# EAGLE design nedo32v1 (EAGLE 5.06)
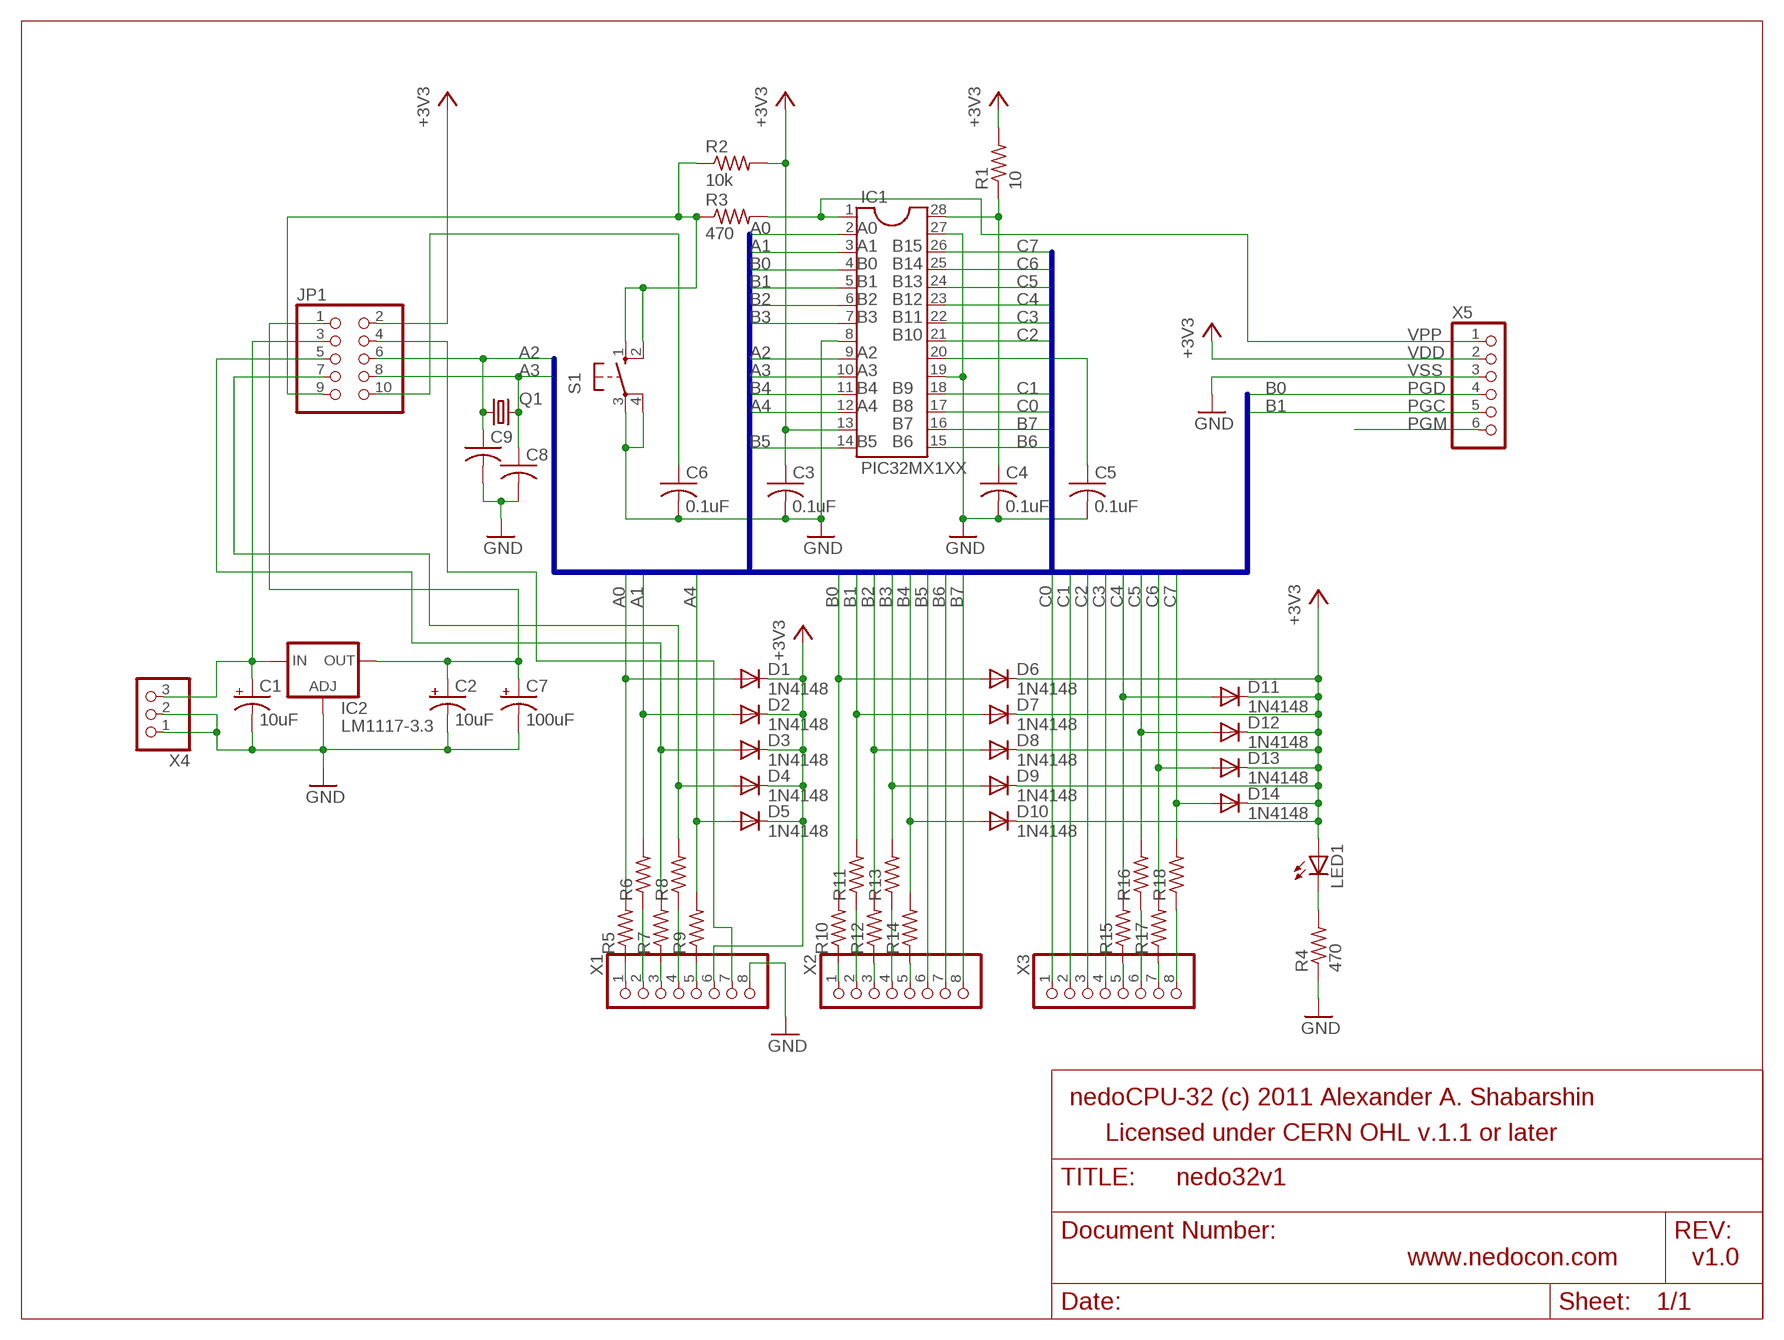
[diagram p0: schematic, sheet 1]

## Parts
C1  10uF  CPOL-USE2,5-6E  [E2,5-6E]
C2  10uF  CPOL-USE2,5-6E  [E2,5-6E]
C3  0.1uF  C-US025-025X050  [C025-025X050]
C4  0.1uF  C-US025-025X050  [C025-025X050]
C5  0.1uF  C-US025-025X050  [C025-025X050]
C6  0.1uF  C-US025-025X050  [C025-025X050]
C7  100uF  CPOL-USE5-8.5  [E5-8,5]
C8  C-US025-024X044  [C025-024X044]
C9  C-US025-024X044  [C025-024X044]
D1  1N4148  1N4148DO35-7  [DO35-7]
D2  1N4148  1N4148DO35-7  [DO35-7]
D3  1N4148  1N4148DO35-7  [DO35-7]
D4  1N4148  1N4148DO35-7  [DO35-7]
D5  1N4148  1N4148DO35-7  [DO35-7]
D6  1N4148  1N4148DO35-7  [DO35-7]
D7  1N4148  1N4148DO35-7  [DO35-7]
D8  1N4148  1N4148DO35-7  [DO35-7]
D9  1N4148  1N4148DO35-7  [DO35-7]
D10  1N4148  1N4148DO35-7  [DO35-7]
D11  1N4148  1N4148DO35-7  [DO35-7]
D12  1N4148  1N4148DO35-7  [DO35-7]
D13  1N4148  1N4148DO35-7  [DO35-7]
D14  1N4148  1N4148DO35-7  [DO35-7]
IC1  PIC32MX1XX  DIL28-3  [DIL28-3]
IC2  LM1117-3.3  LM138-TL  [TO220L1]
JP1  PINHD-2X5  [2X05]
LED1  LED5MM  [LED5MM]
Q1  CRYSTALHC49U-V  [HC49U-V]
R1  10  R-US_0204/7  [0204/7]
R2  10k  R-US_0204/7  [0204/7]
R3  470  R-US_0204/7  [0204/7]
R4  470  R-US_0204/7  [0204/7]
R5  R-US_0204/7  [0204/7]
R6  R-US_0204/7  [0204/7]
R7  R-US_0204/7  [0204/7]
R8  R-US_0204/7  [0204/7]
R9  R-US_0204/7  [0204/7]
R10  R-US_0204/7  [0204/7]
R11  R-US_0204/7  [0204/7]
R12  R-US_0204/7  [0204/7]
R13  R-US_0204/7  [0204/7]
R14  R-US_0204/7  [0204/7]
R15  R-US_0204/7  [0204/7]
R16  R-US_0204/7  [0204/7]
R17  R-US_0204/7  [0204/7]
R18  R-US_0204/7  [0204/7]
S1  10-XX  [B3F-10XX]
X1  PINHD-1X8  [1X08]
X2  PINHD-1X8  [1X08]
X3  PINHD-1X8  [1X08]
X4  PINHD-1X3  [1X03]
X5  PINHD-1X6  [1X06]

## Nets
+3V3: C3.1 D1.C D2.C D3.C D4.C D5.C D6.C D7.C D8.C D9.C D10.C D11.C D12.C D13.C D14.C IC1.13 JP1.2 LED1.A R1.2 R2.2 X1.6 X5.2
A0: D1.A IC1.2 R5.2
A1: D2.A IC1.3 R6.2
A2: C9.1 IC1.9 JP1.6 Q1.1
A3: C8.1 IC1.10 JP1.8 Q1.2
A4: D5.A IC1.12 R9.2
B0: D6.A IC1.4 R10.2 X5.4
B1: D7.A IC1.5 R11.2 X5.5
B2: D8.A IC1.6 R12.2
B3: D9.A IC1.7 R13.2
B4: D10.A IC1.11 R14.2
B5: IC1.14 X2.6
B6: IC1.15 X2.7
B7: IC1.16 X2.8
C0: IC1.17 X3.1
C1: IC1.18 X3.2
C2: IC1.21 X3.3
C3: IC1.22 X3.4
C4: D11.A IC1.23 R15.2
C5: D12.A IC1.24 R16.2
C6: D13.A IC1.25 R17.2
C7: D14.A IC1.26 R18.2
GND: C1.- C2.- C3.2 C4.2 C5.2 C6.2 C7.- C8.2 C9.2 IC1.8 IC1.19 IC1.27 IC2.1(ADJ) R4.1 S1.3(P) S1.4(P1) X1.8 X4.1 X4.2 X5.3
N$1: D3.A JP1.5 R7.2
N$2: IC1.1 R3.2 X5.1
N$3: JP1.9 R2.1 R3.1 S1.1(S) S1.2(S1)
N$4: C6.1 JP1.10
N$5: X5.6
N$6: LED1.K(C) R4.2
N$7: C1.+ IC2.3(IN) JP1.3 X4.3
N$8: C5.1 IC1.20
N$9: JP1.4 X1.7
N$10: C4.1 IC1.28 R1.1
N$11: C2.+ C7.+ IC2.2(OUT) JP1.1
N$12: D4.A JP1.7 R8.2
N$13: R5.1 X1.1
N$14: R6.1 X1.2
N$15: R7.1 X1.3
N$16: R8.1 X1.4
N$17: R9.1 X1.5
N$18: R10.1 X2.1
N$19: R11.1 X2.2
N$20: R12.1 X2.3
N$21: R13.1 X2.4
N$22: R14.1 X2.5
N$23: R15.1 X3.5
N$24: R16.1 X3.6
N$25: R17.1 X3.7
N$26: R18.1 X3.8

## Buses
A[0..4],B[0..7],C[0..7]

## Notes on the sheet
- A0
- A1 | B15
- B0 | B14
- B1 | B13
- B2 | B12
- B3 | B11
- B10 | VPP
- A2 | VDD
- A3 | VSS
- B4 | B9 | PGD
- A4 | B8 | PGC
- B7 | PGM
- B5 | B6
- nedoCPU-32 (c) 2011 Alexander A. Shabarshin
- Licensed under CERN OHL v.1.1 or later
- www.nedocon.com | v1.0

## Library data of the parts
C1 C2 C7 = rcl:CPOL-US: POLARIZED CAPACITOR, American symbol
C3-C6 C8 C9 = rcl:C-US: CAPACITOR, American symbol
D1-D14 = diode:1N4148: DIODE high speed (Philips)
IC1 = ic-package:DIL28: Dual In Line
IC2 = v-reg:LM138-TL: VOLTAGE REGULATOR
JP1 = pinhead:PINHD-2X5: PIN HEADER
LED1 = led:LED: LED OSRAM: - CHIPLED LG R971, LG N971, LY N971, LG Q971, LY Q971, LO R971, LY R971 LH N974, LH R974 LS Q976, LO Q976, LY Q976 LO Q996 - Hyper CHIPLED LW Q18S LB Q993, LB Q99A, LB R99A - SideLED LS A670, LO A670, LY A670, LG A670, LP A670 LB A673, LV A673, LT A673, LW A673 LH A674 LY A675 LS A676, LA A676, LO A676, LY A676, LW A676 LS A679, LY A679, LG A679 - Hyper Micro SIDELED® LS Y876, LA Y876, LO Y876, LY Y876 LT Y87S - SmartLED LW L88C, LW L88S LB L89C, LB L89S, LG L890 LS L89K, LO L89K, LY L89K LS L896, LA L896, LO L896, LY L896 - TOPLED LS T670, LO T670, LY T670, LG T670, LP T670 LSG T670, LSP T670, LSY T670, LOP T670, LYG T670 LG T671, LOG T671, LSG T671 LB T673, LV T673, LT T673, LW T673 LH T674 LS T676, LA T676, LO T676, LY T676, LB T676, LH T676, LSB T676, LW T676 LB T67C, LV T67C, LT T67C, LS T67K, LO T67K, LY T67K, LW E67C LS E67B, LA E67B, LO E67B, LY E67B, LB E67C, LV E67C, LT E67C LW T67C LS T679, LY T679, LG T679 LS T770, LO T770, LY T770, LG T770, LP T770 LB T773, LV T773, LT T773, LW T773 LH T774 LS E675, LA E675, LY E675, LS T675 LS T776, LA T776, LO T776, LY T776, LB T776 LHGB T686 LT T68C, LB T68C - Hyper Mini TOPLED® LB M676 - Mini TOPLED Santana® LG M470 LS M47K, LO M47K, LY M47K Source: http://www.osram.convergy.de LUXEON: - LUMILED® LXK2-PW12-R00, LXK2-PW12-S00, LXK2-PW14-U00, LXK2-PW14-V00 LXK2-PM12-R00, LXK2-PM12-S00, LXK2-PM14-U00 LXK2-PE12-Q00, LXK2-PE12-R00, LXK2-PE12-S00, LXK2-PE14-T00, LXK2-PE14-U00 LXK2-PB12-K00, LXK2-PB12-L00, LXK2-PB12-M00, LXK2-PB14-N00, LXK2-PB14-P00, LXK2-PB14-Q00 LXK2-PR12-L00, LXK2-PR12-M00, LXK2-PR14-Q00, LXK2-PR14-R00 LXK2-PD12-Q00, LXK2-PD12-R00, LXK2-PD12-S00 LXK2-PH12-R00, LXK2-PH12-S00 LXK2-PL12-P00, LXK2-PL12-Q00, LXK2-PL12-R00 Source: www.luxeon.com KINGBRIGHT: KA-3528ASYC Source: www.kingbright.com
Q1 = crystal:CRYSTAL: CRYSTAL
R1-R18 = rcl:R-US_: RESISTOR, American symbol
S1 = switch-omron:10-XX: OMRON SWITCH
X1-X3 = pinhead:PINHD-1X8: PIN HEADER
X4 = pinhead:PINHD-1X3: PIN HEADER
X5 = pinhead:PINHD-1X6: PIN HEADER

## Board
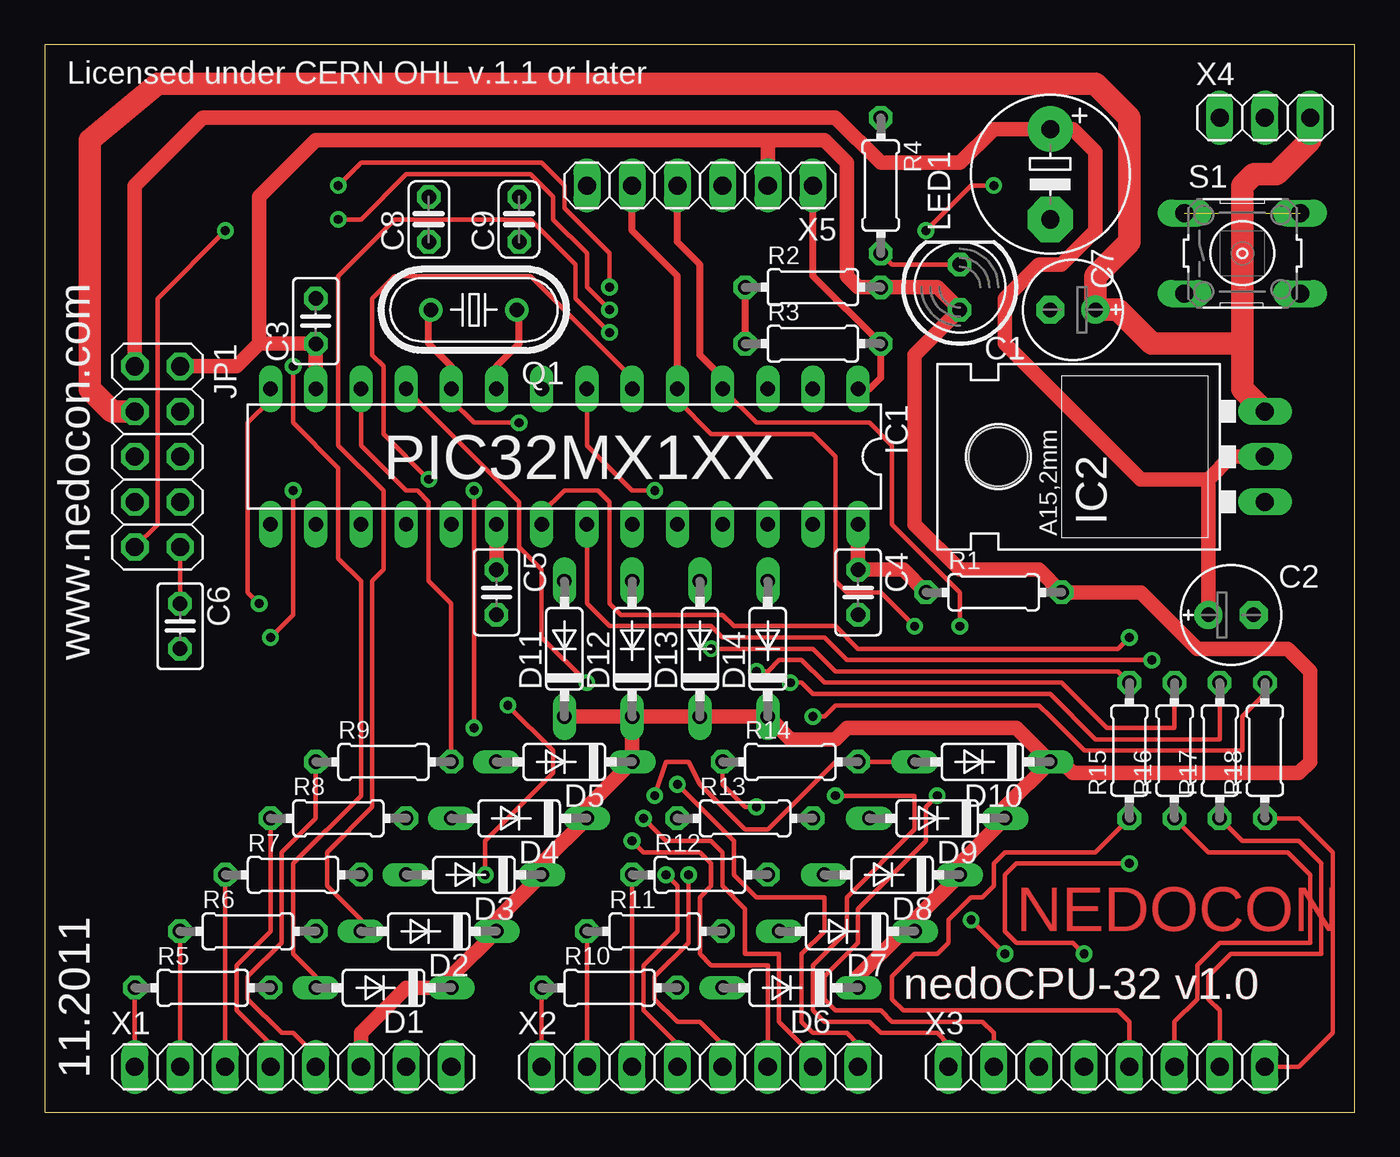
[diagram p1: board, top side]
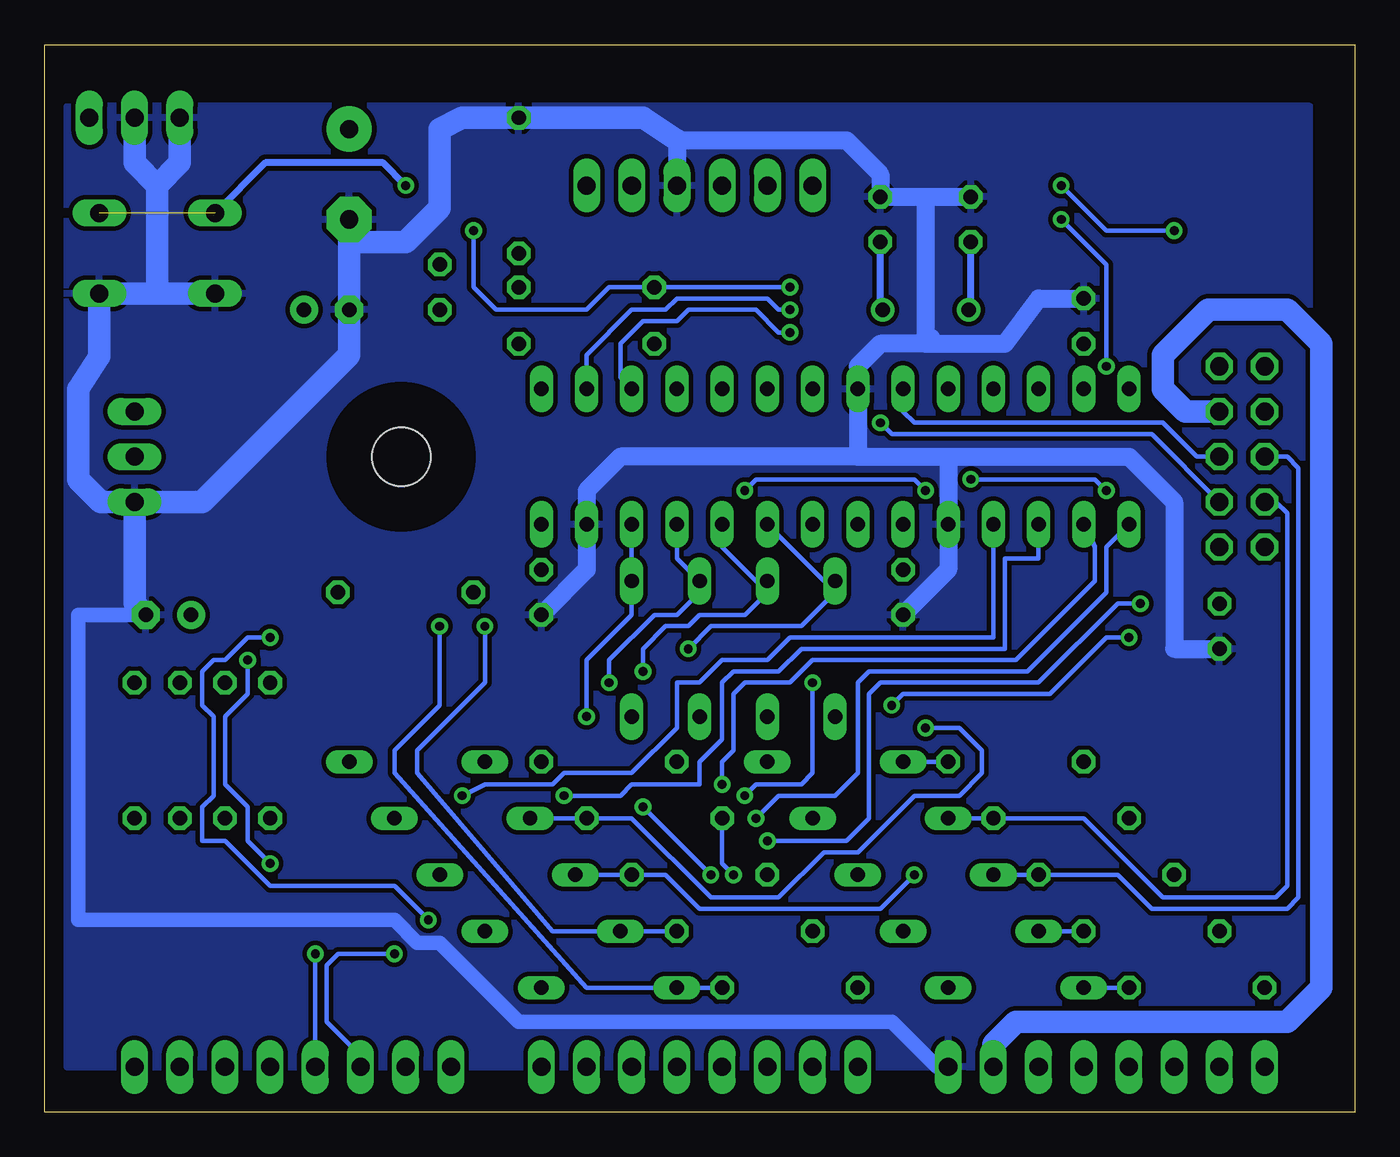
[diagram p2: board, bottom side, seen from below]

Size 73.64 x 59.99 mm. Coordinates in mm from the lower left corner, seen from the top.
Outline: 0,0 73.64,0 73.64,59.99 0,59.99 0,0
Copper layers (1*16): Top 0.035mm / dielectric 1.5mm / Bottom 0.035mm
Design rules "default *": minimum track width 10mil, minimum drill 19mil, track to track 10mil, track to pad 10mil, pad to pad 10mil, via to via 10mil, smd to smd 10mil, copper to edge 40mil, drill to drill 10mil, minimum pad ring 10mil, minimum via ring 8mil, stop-mask expansion 4mil, vias tented up to drill 0mil, thermal gap 10mil

### Footprints (pad centres in the part's own frame; a part is rotated, then mirrored left to right if it is on the bottom)
E2,5-6E = drill 0.813 pad 1.575 round: + -1.27,0 | drill 0.813 pad 1.575 octagon: - 1.27,0
C025-025X050 = drill 0.813 octagon: 1 -1.27,0; 2 1.27,0
E5-8,5 = drill 1.016 pad 2.54 round: + -2.54,0 | drill 1.016 pad 2.54 octagon: - 2.54,0
C025-024X044 = drill 0.813 octagon: 1 -1.27,0; 2 1.27,0
DO35-7 = drill 0.813 long: A 3.81,0; C -3.81,0
DIL28-3 = drill 0.813 long: 1 -16.51,-3.81; 2 -13.97,-3.81; 3 -11.43,-3.81; 4 -8.89,-3.81; 5 -6.35,-3.81; 6 -3.81,-3.81; 7 -1.27,-3.81; 8 1.27,-3.81; 9 3.81,-3.81; 10 6.35,-3.81; 11 8.89,-3.81; 12 11.43,-3.81; 13 13.97,-3.81; 14 16.51,-3.81; 15 16.51,3.81; 16 13.97,3.81; 17 11.43,3.81; 18 8.89,3.81; 19 6.35,3.81; 20 3.81,3.81; 21 1.27,3.81; 22 -1.27,3.81; 23 -3.81,3.81; 24 -6.35,3.81; 25 -8.89,3.81; 26 -11.43,3.81; 27 -13.97,3.81; 28 -16.51,3.81
TO220L1 = drill 1.016 long: 1 -2.54,-3.81; 2 0,-3.81; 3 2.54,-3.81 | hole 3.302: 0,11.176
2X05 = drill 1.016 octagon: 1 -5.08,-1.27; 2 -5.08,1.27; 3 -2.54,-1.27; 4 -2.54,1.27; 5 0,-1.27; 6 0,1.27; 7 2.54,-1.27; 8 2.54,1.27; 9 5.08,-1.27; 10 5.08,1.27
LED5MM = drill 0.813 octagon: A -1.27,0; K 1.27,0
HC49U-V = drill 0.813 round: 1 -2.413,0; 2 2.413,0
0204/7 = drill 0.813 octagon: 1 -3.81,0; 2 3.81,0
B3F-10XX = drill 1.016 long: 1 -3.251,2.261; 2 3.251,2.261; 3 -3.251,-2.261; 4 3.251,-2.261
1X08 = drill 1.016 long: 1 -8.89,0; 2 -6.35,0; 3 -3.81,0; 4 -1.27,0; 5 1.27,0; 6 3.81,0; 7 6.35,0; 8 8.89,0
1X03 = drill 1.016 long: 1 -2.54,0; 2 0,0; 3 2.54,0
1X06 = drill 1.016 long: 1 -6.35,0; 2 -3.81,0; 3 -1.27,0; 4 1.27,0; 5 3.81,0; 6 6.35,0

### Placement (x,y rotation side)
C1  57.78,45.09 180 top
C2  66.67,27.94 0 top
C3  15.24,44.45 90 top
C4  45.72,29.21 270 top
C5  25.4,29.21 270 top
C6  7.62,27.3 270 top
C7  56.52,52.7 270 top
C8  21.59,50.16 90 top
C9  26.67,50.16 90 top
D1  19.05,6.99 180 top
D2  21.59,10.16 180 top
D3  24.13,13.34 180 top
D4  26.67,16.51 180 top
D5  29.21,19.68 180 top
D6  41.91,6.99 180 top
D7  45.09,10.16 180 top
D8  47.62,13.34 180 top
D9  50.16,16.51 180 top
D10  52.7,19.68 180 top
D11  29.21,26.04 90 top
D12  33.02,26.04 90 top
D13  36.83,26.04 90 top
D14  40.64,26.04 90 top
IC1  29.21,36.83 180 top
IC2  64.77,36.83 90 top
JP1  6.35,36.83 270 top
LED1  51.44,46.35 90 top
Q1  24.13,45.09 180 top
R1  53.34,29.21 0 top
R2  43.18,46.35 0 top
R3  43.18,43.18 0 top
R4  46.99,52.07 270 top
R5  8.89,6.99 0 top
R6  11.43,10.16 0 top
R7  13.97,13.34 0 top
R8  16.51,16.51 0 top
R9  19.05,19.68 0 top
R10  31.75,6.99 0 top
R11  34.29,10.16 0 top
R12  36.83,13.34 0 top
R13  39.37,16.51 0 top
R14  41.91,19.68 0 top
R15  60.96,20.32 90 top
R16  63.5,20.32 90 top
R17  66.04,20.32 90 top
R18  68.58,20.32 90 top
S1  67.31,48.26 0 top
X1  13.97,2.54 0 top
X2  36.83,2.54 0 top
X3  59.69,2.54 0 top
X4  68.58,55.88 0 top
X5  36.83,52.07 180 top

### Tracks (layer width: path | path; a pad name or v marks a point on that pad's centre or on a via)
+3V3
  Top 0.813: IC1.13 C3.1 12.06,43.18 | JP1.2 10.79,41.91 12.06,43.18 | 40.64,54.61 X5.2 | 40.64,54.61 15.24,54.61 12.06,51.44 12.06,43.18 | 40.64,54.61 43.81,54.61 45.09,53.34 45.09,46.99 45.72,46.35 R2.2 50.16,46.35 LED1.A 48.9,42.55 48.9,33.02 51.44,30.48 55.88,30.48 R1.2 61.59,29.21 64.77,26.04 69.85,26.04 71.12,24.77 71.12,19.68 70.48,19.05 57.78,19.05 57.15,19.68 D10.C | X1.6 17.78,4.45 20.32,6.99 D1.C 22.86,7.62 D2.C 25.4,10.79 D3.C 27.94,13.97 D4.C 30.48,17.14 D5.C D12.C | D12.C D11.C | D12.C D13.C D14.C 41.91,20.95 44.45,20.95 45.09,21.59 54.61,21.59 D10.C | D10.C 53.98,17.14 D9.C 51.44,13.97 D8.C 48.9,10.79 D7.C 48.26,10.16 45.72,7.62 D6.C
A0  (via drill 0.5 pad 0.94)
  Top 0.254: D1.A 15.24,7.62 13.97,8.89 13.97,13.97 17.78,17.78 17.78,29.84 16.51,31.11 16.51,36.2 13.97,38.73 v13.97,41.91 | v16.51,50.16 17.78,50.16 20.32,52.7 27.3,52.7 28.57,51.44 28.57,50.16 30.48,48.26 30.48,46.35 v31.75,45.09
  Bottom 0.254: R5.2 D1.A | v13.97,41.91 13.97,47.62 v16.51,50.16 | v31.75,45.09 32.38,45.09 33.02,45.72 38.1,45.72 38.73,45.09 40.64,45.09 43.18,42.55 IC1.2
A1  (via drill 0.5 pad 0.94)
  Top 0.254: D2.A 17.78,10.79 15.88,12.7 15.88,14.61 18.41,17.14 18.41,29.84 19.05,30.48 19.05,34.92 16.51,37.47 16.51,46.99 19.68,50.16 27.3,50.16 29.84,47.62 29.84,45.72 v31.75,43.81
  Bottom 0.254: R6.2 D2.A | v31.75,43.81 32.38,43.81 33.66,45.09 37.47,45.09 38.1,44.45 40.01,44.45 41.27,43.18 41.27,41.27 IC1.3
A2
  Top 0.406: IC1.9 25.4,41.91 26.67,43.18 26.67,44.96 Q1.1
  Bottom 0.254: IC1.9 25.4,39.37 24.77,38.73 10.79,38.73 8.89,36.83 JP1.6
  Bottom 0.406: C9.1 26.67,45.21 Q1.1
A3  (via drill 0.5 pad 0.94)
  Top 0.254: v26.67,38.73 24.13,38.73 22.86,40.01 IC1.10
  Top 0.406: IC1.10 22.86,41.91 21.59,43.18 21.59,44.96 Q1.2
  Bottom 0.254: JP1.8 11.43,38.1 26.04,38.1 v26.67,38.73
  Bottom 0.406: C8.1 21.59,45.21 Q1.2
A4
  Top 0.254: R9.2 22.86,28.57 21.59,29.84 21.59,34.29 20.95,34.92 20.32,34.92 17.78,37.47 IC1.12
  Bottom 0.254: R9.2 D5.A
B0  (via drill 0.5 pad 0.94)
  Top 0.254: IC1.4 40.01,38.73 46.35,38.73 47.62,37.47 47.62,33.02 51.44,29.21 v51.44,27.3
  Top 0.406: IC1.4 38.1,41.27 36.83,42.55 36.83,47.62 35.56,48.9 X5.4
  Bottom 0.254: R10.2 D6.A 43.18,6.99 53.98,19.05 53.98,20.32 51.44,22.86 v51.44,27.3
B1  (via drill 0.5 pad 0.94)
  Top 0.254: IC1.5 35.56,40.01 37.47,38.1 43.18,38.1 44.45,36.83 44.45,29.84 45.09,29.21 46.99,29.21 v48.9,27.3
  Top 0.406: IC1.5 35.56,46.99 33.02,49.53 X5.5
  Bottom 0.254: R11.2 D7.A 45.09,10.16 52.7,19.05 52.7,20.32 48.9,24.13 v48.9,27.3
B2  (via drill 0.5 pad 0.94)
  Top 0.254: v24.77,13.34 24.77,15.24 28.57,19.05 28.57,20.32 v26.04,22.86 | v12.7,26.67 13.97,27.94 v13.97,34.92 | v21.59,35.56 19.05,38.1 19.05,41.91 18.41,42.55 18.41,45.72 19.68,46.99 27.3,46.99 33.02,41.27 IC1.6
  Bottom 0.254: D8.A R12.2 38.73,13.34 36.83,11.43 26.67,11.43 v24.77,13.34 | v26.04,22.86 25.4,23.5 17.14,23.5 13.97,26.67 v12.7,26.67 | v13.97,34.92 14.61,35.56 v21.59,35.56
B3  (via drill 0.5 pad 0.94)
  Top 0.254: v24.13,21.59 v24.13,34.92 | v34.29,34.92 33.02,34.92 30.48,37.47 IC1.7
  Bottom 0.254: D9.A R13.2 40.64,16.51 36.2,12.06 32.38,12.06 29.84,14.61 27.94,14.61 24.77,17.78 22.23,17.78 20.95,19.05 20.95,20.32 22.23,21.59 v24.13,21.59 | v24.13,34.92 24.77,35.56 33.66,35.56 v34.29,34.92
B4  (via drill 0.5 pad 0.94)
  Top 0.254: D10.A R14.2 44.45,19.68 40.64,15.88 39.37,15.88 36.83,18.41 36.2,19.68 34.92,19.68 v34.29,17.78 | v30.48,24.13 27.94,26.67 27.94,30.48 26.67,31.75 26.67,34.29 IC1.11
  Bottom 0.254: v34.29,17.78 33.66,18.41 31.11,18.41 30.48,19.05 v30.48,24.13
B5  (via drill 0.5 pad 0.94)
  Top 0.254: X2.6 40.64,8.26 37.47,8.26 36.83,8.89 36.83,12.06 37.47,12.7 37.47,13.97 36.83,14.61 33.66,14.61 v33.02,15.24 | v12.06,28.57 11.43,29.21 11.43,38.73 12.7,40.01 IC1.14
  Bottom 0.254: v33.02,15.24 28.57,15.24 27.3,16.51 27.3,23.5 26.67,24.13 17.78,24.13 13.34,28.57 v12.06,28.57
B6  (via drill 0.5 pad 0.94)
  Top 0.254: X2.7 43.18,3.17 41.27,5.08 41.27,8.89 39.37,8.89 39.37,11.43 38.1,12.7 38.1,14.61 37.47,15.24 34.92,15.24 v33.66,16.51
  Bottom 0.254: v33.66,16.51 32.38,17.78 29.21,17.78 27.94,19.05 27.94,24.13 27.3,24.77 18.41,24.77 13.97,29.21 13.97,31.75 IC1.15
B7  (via drill 0.5 pad 0.94)
  Top 0.254: X2.8 45.72,3.81 45.09,4.45 43.18,4.45 42.55,5.08 42.55,8.89 43.81,10.16 43.81,12.06 40.01,12.06 38.73,13.34 38.73,15.24 v35.56,18.41
  Bottom 0.254: v35.56,18.41 35.56,19.68 34.92,20.32 34.92,23.5 34.29,24.13 31.75,24.13 30.48,25.4 19.05,25.4 14.61,29.84 14.61,31.75 IC1.16
C0  (via drill 0.5 pad 0.94)
  Top 0.254: X3.1 50.8,3.81 50.16,4.45 46.99,4.45 46.35,5.08 43.81,5.08 43.18,5.71 43.18,8.26 45.09,10.16 45.09,12.06 48.9,15.88 48.9,17.78 v44.45,17.78
  Bottom 0.254: v44.45,17.78 41.27,17.78 40.64,18.41 36.83,18.41 36.83,19.68 35.56,20.95 35.56,24.13 34.92,24.77 32.38,24.77 31.11,26.04 19.68,26.04 19.68,31.11 17.78,31.11 IC1.17
C1  (via drill 0.5 pad 0.94)
  Top 0.254: X3.2 53.34,4.45 52.7,5.08 47.62,5.08 46.99,5.71 44.45,5.71 43.81,6.35 43.81,7.62 45.72,9.53 45.72,11.43 49.53,15.24 49.53,17.14 v50.16,17.78
  Bottom 0.254: v50.16,17.78 48.9,18.41 45.09,18.41 44.45,19.05 40.64,19.05 38.1,21.59 38.1,24.13 36.83,24.13 35.56,25.4 33.02,25.4 31.75,26.67 20.32,26.67 IC1.18
C2  (via drill 0.5 pad 0.94)
  Top 0.254: IC1.21 27.94,33.66 29.21,34.92 31.11,34.92 31.75,34.29 31.75,28.57 32.38,27.94 38.1,27.94 38.73,27.3 44.45,27.3 45.72,26.04 60.33,26.04 v60.96,26.67 | v53.98,8.89 v52.07,10.79
  Bottom 0.254: v60.96,26.67 62.23,26.67 63.5,25.4 64.14,25.4 64.77,24.77 64.77,22.86 64.14,22.23 64.14,17.78 64.77,17.14 64.77,15.24 63.5,15.24 60.96,12.7 53.98,12.7 v52.07,10.79 | v53.98,8.89 57.15,8.89 57.78,8.26 57.78,5.08 55.88,3.17 X3.3
C3  (via drill 0.5 pad 0.94)
  Top 0.254: v58.42,8.89 57.78,9.53 54.61,9.53 53.98,10.16 53.98,13.34 54.61,13.97 v60.96,13.97 | v62.23,25.4 45.09,25.4 43.81,26.67 38.1,26.67 37.47,27.3 31.75,27.3 30.48,28.57 IC1.22
  Bottom 0.254: v58.42,8.89 X3.4 | v60.96,13.97 62.23,15.24 62.23,17.14 63.5,18.41 63.5,22.23 62.23,23.5 v62.23,25.4
C4  (via drill 0.5 pad 0.94)
  Top 0.254: v37.47,26.04 43.18,26.04 44.45,24.77 60.33,24.77 R15.2
  Bottom 0.254: IC1.23 29.84,29.84 D11.A 29.21,29.21 31.11,27.3 36.2,27.3 v37.47,26.04
C5  (via drill 0.5 pad 0.94)
  Top 0.254: v40.01,24.77 40.64,24.77 41.27,25.4 42.55,25.4 43.81,24.13 57.15,24.13 59.69,21.59 63.5,21.59 R16.2
  Bottom 0.254: IC1.24 35.56,31.75 33.02,29.21 | D12.A 33.02,29.21 | 33.02,29.21 34.29,27.94 36.83,27.94 37.47,27.3 38.73,27.3 40.01,26.04 v40.01,24.77
C6  (via drill 0.5 pad 0.94)
  Top 0.254: v41.91,24.13 42.55,24.13 43.18,23.5 56.52,23.5 59.05,20.95 66.04,20.95 R17.2
  Bottom 0.254: IC1.25 38.1,31.11 D13.A 36.83,29.21 38.1,27.94 39.37,27.94 41.91,25.4 v41.91,24.13
C7  (via drill 0.5 pad 0.94)
  Top 0.254: R18.2 68.58,23.5 67.31,22.23 67.31,20.32 58.42,20.32 56.52,22.23 55.88,22.86 44.45,22.86 43.81,22.23 v43.18,22.23
  Bottom 0.254: IC1.26 D14.A 40.64,27.94 43.18,25.4 v43.18,22.23
GND
  Bottom 0.813: X1.8 23.5,2.54 26.04,5.08 46.99,5.08 51.44,9.53 52.7,9.53 53.98,10.79 71.75,10.79 71.75,27.94 C2.-
  Bottom 1.016: C5.2 22.86,30.48 IC1.19 22.86,36.83 | 27.94,36.83 22.86,36.83 | 27.94,36.83 IC1.8 27.94,41.91 26.67,43.18 24.13,43.18 | 24.13,51.44 24.13,43.18 | 24.13,51.44 C8.2 | 24.13,51.44 C9.2 26.67,52.7 28.57,54.61 38.1,54.61 X5.3 | C3.2 17.78,45.72 19.68,43.18 24.13,43.18 | 24.13,43.18 23.81,43.5 | 27.94,36.83 41.27,36.83 43.18,34.92 IC1.27 43.18,30.48 C4.2 | C6.2 10.16,26.04 10.16,34.29 12.7,36.83 22.86,36.83
  Bottom 1.27: 67.31,46 S1.4 70.56,42.47 71.75,40.64 71.75,35.56 70.48,34.29 IC2.1 | 67.31,46 S1.3 63.22,46 | 67.31,46 67.31,52.07 | 67.31,52.07 68.58,53.34 X4.2 | X4.1 66.04,53.34 67.31,52.07 | IC2.1 68.58,28.57 C2.- | IC2.1 64.77,34.29 56.52,42.55 C1.- 56.52,48.9 | 56.52,48.9 C7.- | 38.1,54.61 40.01,55.88 R4.1 50.16,55.88 51.44,55.24 51.44,50.8 53.34,48.9 56.52,48.9
  pour Bottom: 2.54,56.52 72.39,56.52 72.39,2.54 2.54,2.54
N$1
  Bottom 0.254: D3.A R7.2 13.34,13.34 11.43,11.43 3.81,11.43 3.17,12.06 3.17,36.2 3.81,36.83 JP1.5
N$2
  Top 0.406: IC1.1 46.35,40.64 46.99,41.27 R3.2 43.18,46.99 X5.1
N$3  (via drill 0.5 pad 0.94)  (1 unrouted)
  Top 0.254: v53.34,52.07 52.07,52.07 v49.53,49.53 | JP1.9 6.35,33.02 6.35,45.72 v10.16,49.53 | v16.51,52.07 17.78,53.34 27.94,53.34 29.21,52.07 29.21,50.8 31.75,48.26 v31.75,46.35
  Top 0.406: R2.1 R3.1
  Bottom 0.254: v49.53,49.53 49.53,46.35 48.26,45.09 43.18,45.09 41.91,46.35 R2.1 v31.75,46.35 | v10.16,49.53 13.97,49.53 v16.51,52.07
  Bottom 0.406: v53.34,52.07 54.61,53.34 61.24,53.34 S1.1
N$4
  Top 0.254: C6.1 JP1.10
N$6
  Top 0.254: LED1.K 47.62,47.62 R4.2
N$7
  Top 1.27: X4.3 71.12,54.61 69.22,52.7 67.94,52.7 67.31,52.07 67.31,43.18 | 67.31,43.18 67.31,40.64 IC2.3 | 67.31,43.18 62.23,43.18 60.33,45.09 C1.+ 59.05,46.99 60.96,48.9 60.96,55.88 59.05,57.78 6.35,57.78 2.54,54.61 2.54,40.64 3.81,39.37 JP1.3
N$8
  Top 0.813: C5.1 IC1.20
N$9
  Bottom 1.27: X1.7 20.32,3.81 19.05,5.08 3.81,5.08 1.91,6.99 1.91,43.18 3.81,45.09 8.26,45.09 10.79,42.55 10.79,40.64 9.53,39.37 JP1.4
N$10
  Top 0.813: IC1.28 C4.1 48.26,30.48 R1.1
N$11
  Top 0.813: JP1.1 5.08,52.07 8.89,55.88 44.45,55.88 46.99,53.34 51.44,53.34 53.34,55.24 C7.+ 57.78,55.24 59.05,53.98 59.05,49.53 57.15,47.62 55.88,47.62 53.98,45.72 53.98,43.18 61.59,35.56 65.41,35.56 | 65.41,35.56 C2.+ | 65.41,35.56 66.67,36.83 IC2.2
N$12
  Bottom 0.254: D4.A R8.2 15.24,16.51 10.79,12.06 4.45,12.06 3.81,12.7 3.81,33.66 4.45,34.29 JP1.7
N$13
  Top 0.254: X1.1 R5.1
N$14
  Top 0.254: X1.2 R6.1
N$15
  Top 0.254: X1.3 R7.1
N$16
  Top 0.254: X1.4 12.7,3.81 10.79,5.71 10.79,8.26 12.7,10.16 R8.1
N$17
  Top 0.254: X1.5 15.24,3.17 13.97,4.45 13.34,4.45 11.43,6.35 11.43,7.62 13.34,9.53 13.34,14.61 15.24,16.51 R9.1
N$18
  Top 0.254: X2.1 R10.1
N$19
  Top 0.254: X2.2 R11.1
N$20
  Top 0.254: X2.3 R12.1
N$21  (via drill 0.5 pad 0.94)
  Top 0.254: X2.4 35.56,3.81 33.66,5.71 33.66,8.26 35.56,10.16 35.56,12.7 v34.92,13.34
  Bottom 0.254: v34.92,13.34 35.56,13.97 R13.1
N$22  (via drill 0.5 pad 0.94)
  Top 0.254: X2.5 38.1,3.81 36.83,5.08 35.56,5.08 34.29,6.35 34.29,7.62 36.2,9.53 v36.2,13.34 | v40.01,17.14 39.37,17.14 38.1,18.41 R14.1
  Bottom 0.254: v36.2,13.34 v40.01,17.14
N$23
  Top 0.254: X3.5 60.96,5.08 60.33,5.71 48.26,5.71 47.62,6.35 47.62,7.62 48.9,8.89 50.16,8.89 50.8,9.53 50.8,10.79 52.07,12.06 52.7,12.06 53.34,12.7 53.34,13.97 53.98,14.61 59.05,14.61 R15.1
N$24
  Top 0.254: X3.6 63.5,5.08 64.77,6.35 64.77,8.26 66.04,9.53 71.12,9.53 71.12,13.34 69.85,14.61 65.41,14.61 R16.1
N$25
  Top 0.254: X3.7 66.04,5.71 65.41,6.35 65.41,7.62 66.67,8.89 71.75,8.89 71.75,13.97 70.48,15.24 67.31,15.24 R17.1
N$26
  Top 0.254: R18.1 70.48,16.51 72.39,14.61 72.39,4.45 70.48,2.54 X3.8

### Text on the board
Top: NEDOCON | nedoCPU-32 v1.0
tNames: Licensed under CERN OHL v.1.1 or later | PIC32MX1XX | www.nedocon.com | nedoCPU-32 v1.0 | 11.2011